# Altium schematic sheet 04-USB.SchDoc
size A
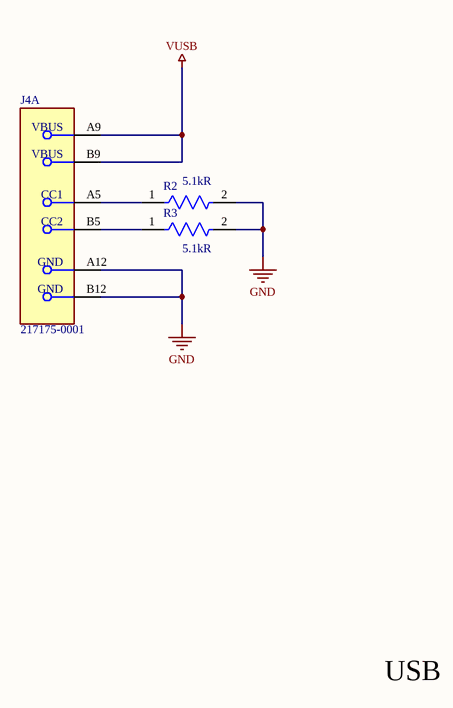
[diagram p0: 04-USB.SchDoc]

## Parts
J4  217175-0001  [FP-217175-0001-MFG]  (part A of 2)
R2  5.1kR  [FP-RN73R2A-IPC_C]
R3  5.1kR  [FP-RN73R2A-IPC_C]

## Nets
GND: J4.A12(GND) J4.B12(GND) R2.2 R3.2
VUSB: J4.A9(VBUS) J4.B9(VBUS)
NetJ4_A5: J4.A5(CC1) R2.1
NetJ4_B5: J4.B5(CC2) R3.1

## Notes on the sheet
- USB

## Library data of the parts
J4 = CMP-04767-000026-1: CONN RCP USB2.0 C 6+18P SMD RA
R2 R3 = CMP-04015-014497-1: 5.1kΩ ±0.05% 0.125W, 1/8W Chip Resistor 0805 (2012 Metric) Moisture Resistant Thin Film